# EasyEDA Pro project ProPrj_STM32音响_2025-06-08.epro, schematic Flash&±5V

## Sheets
1 W25Q Flash: Board Name: FLASH@W25Q128; Create Date: 2025-03-12; Page Name: FLASH@W25Q128; Project Name: SCH_FLASH-W25Q128_2025-03-12; Schematic Name: FLASH@W25Q128; Update Date: 2025-03-15; Add into BOM: yes; Convert to PCB: yes; Date: 2017-05-22; Draw By: jixin003; REV: 1.0; Sheet: 1/1
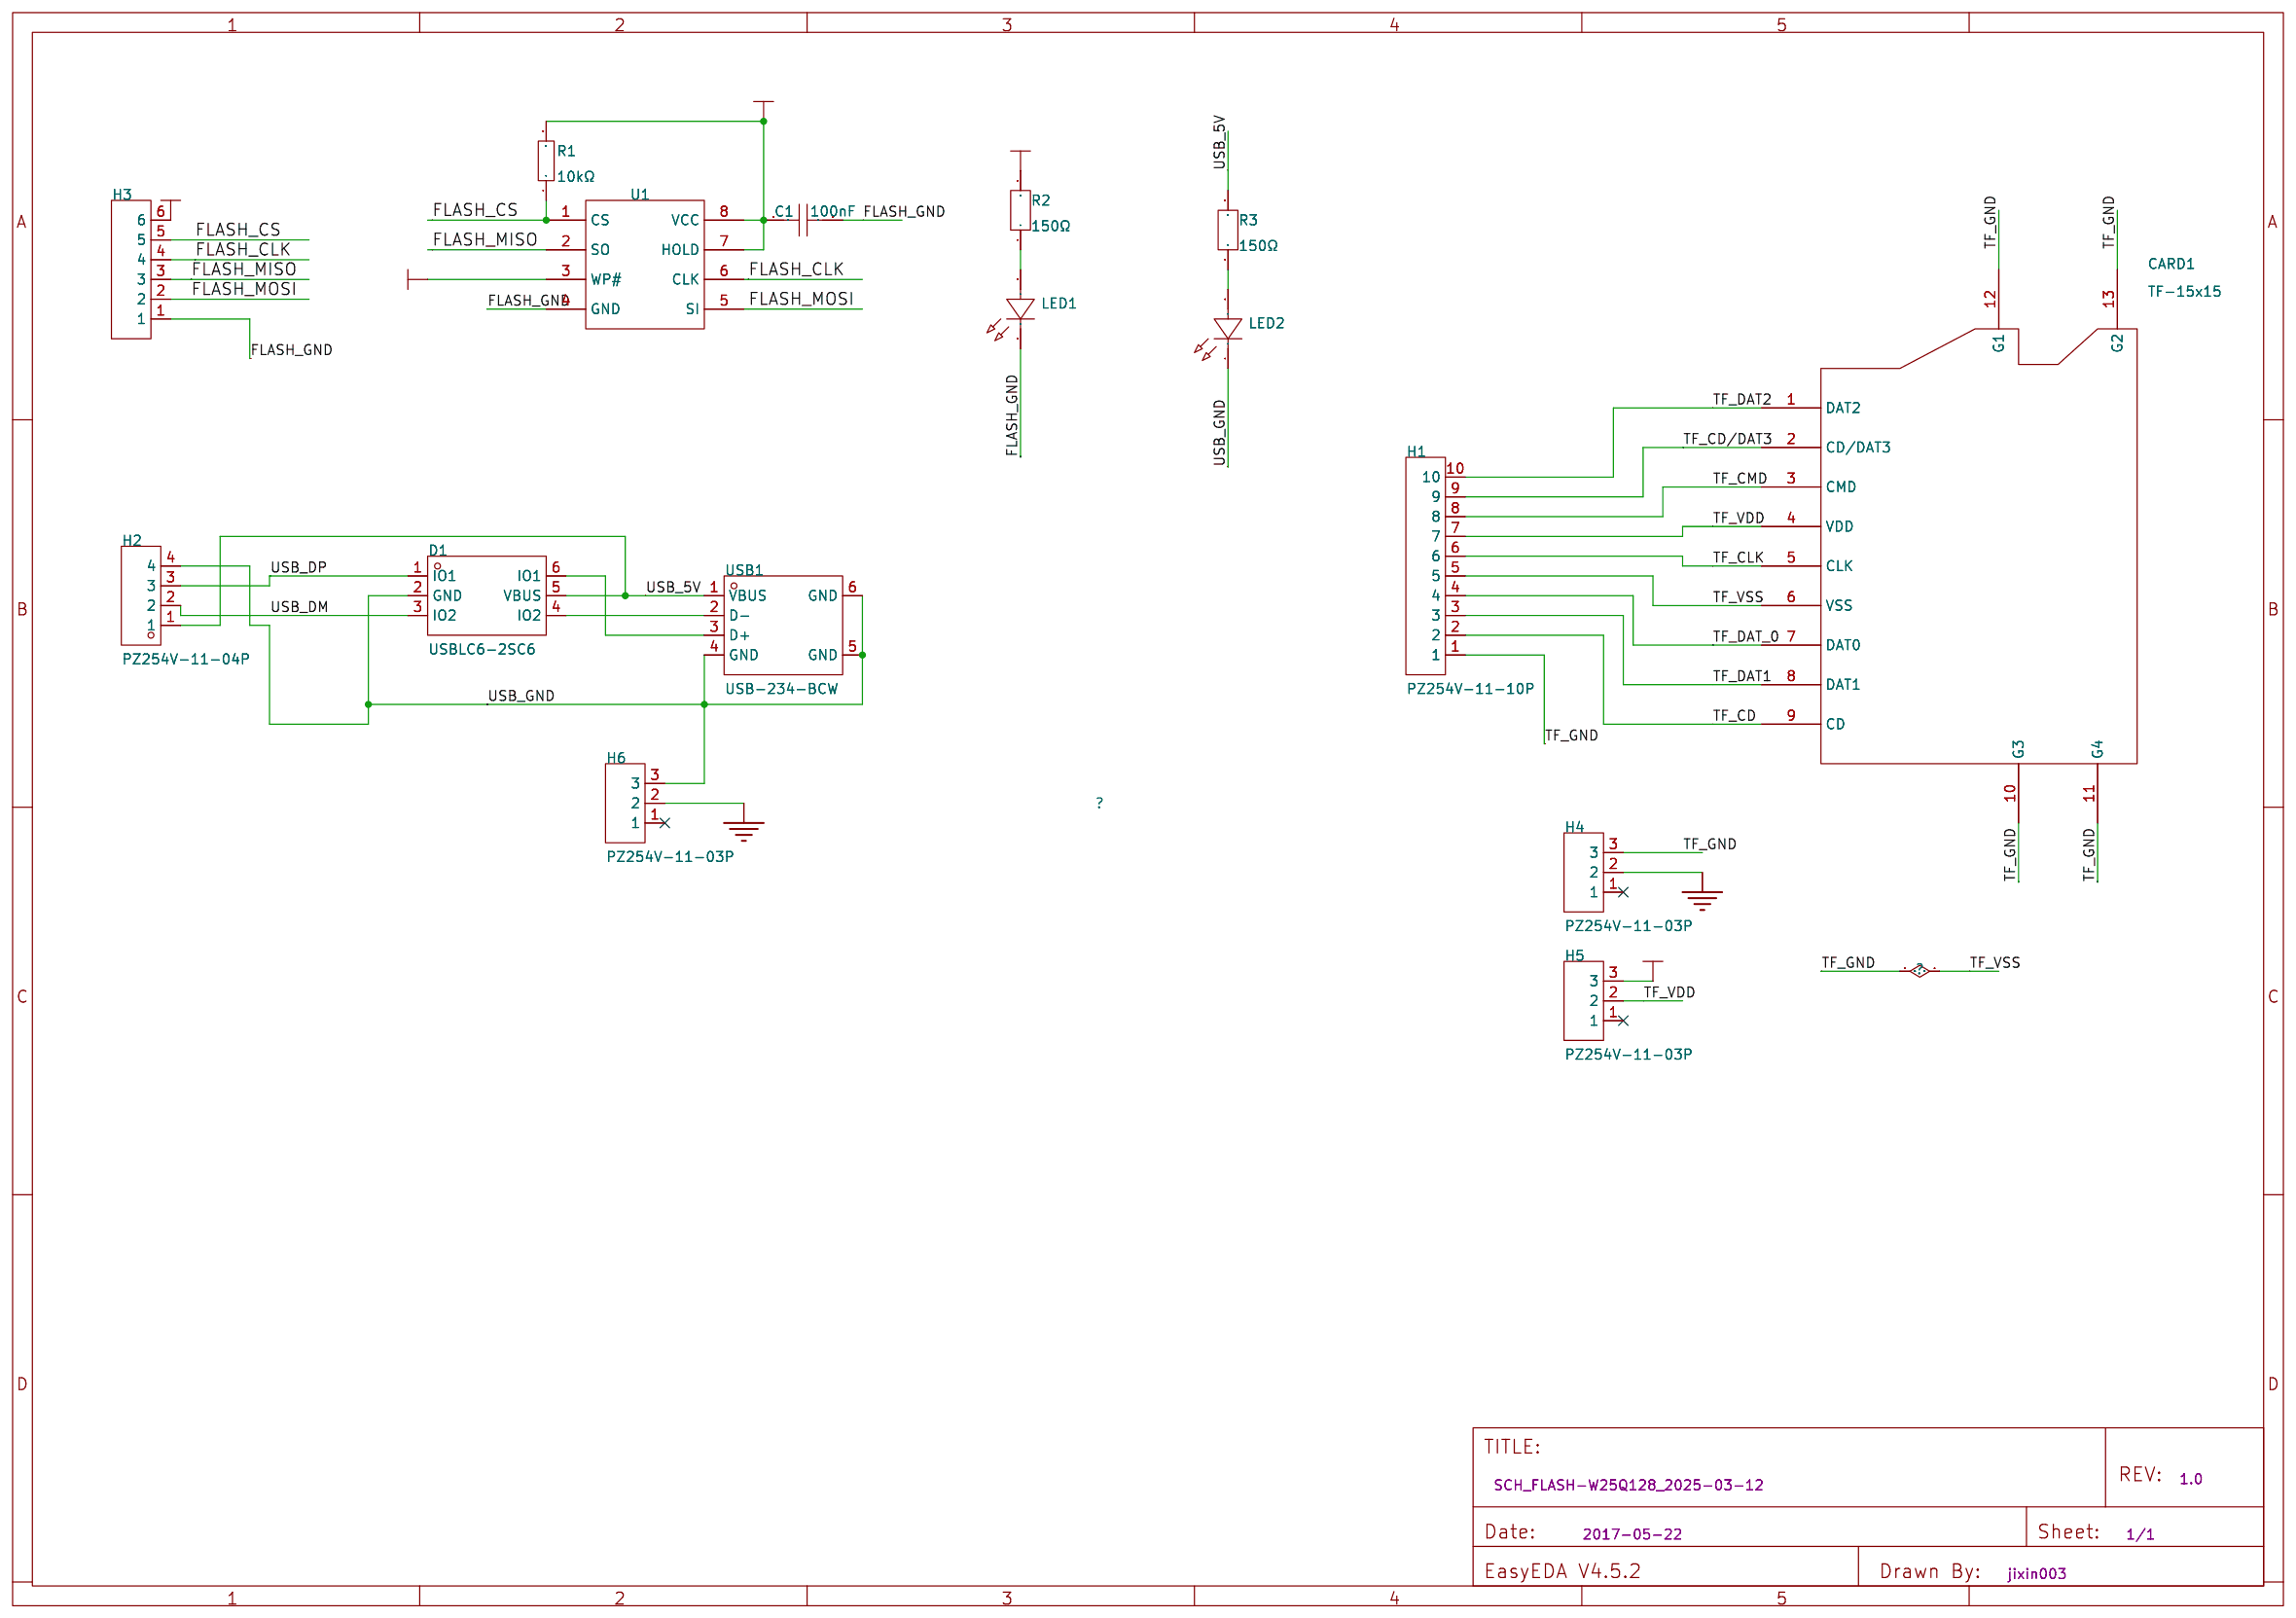
[diagram p2: W25Q Flash]
2 ±5V: Create Date: 2025-03-15; Page Name: P2; Company: 嘉立创EDA; Page Size: A4; Version: V1.0
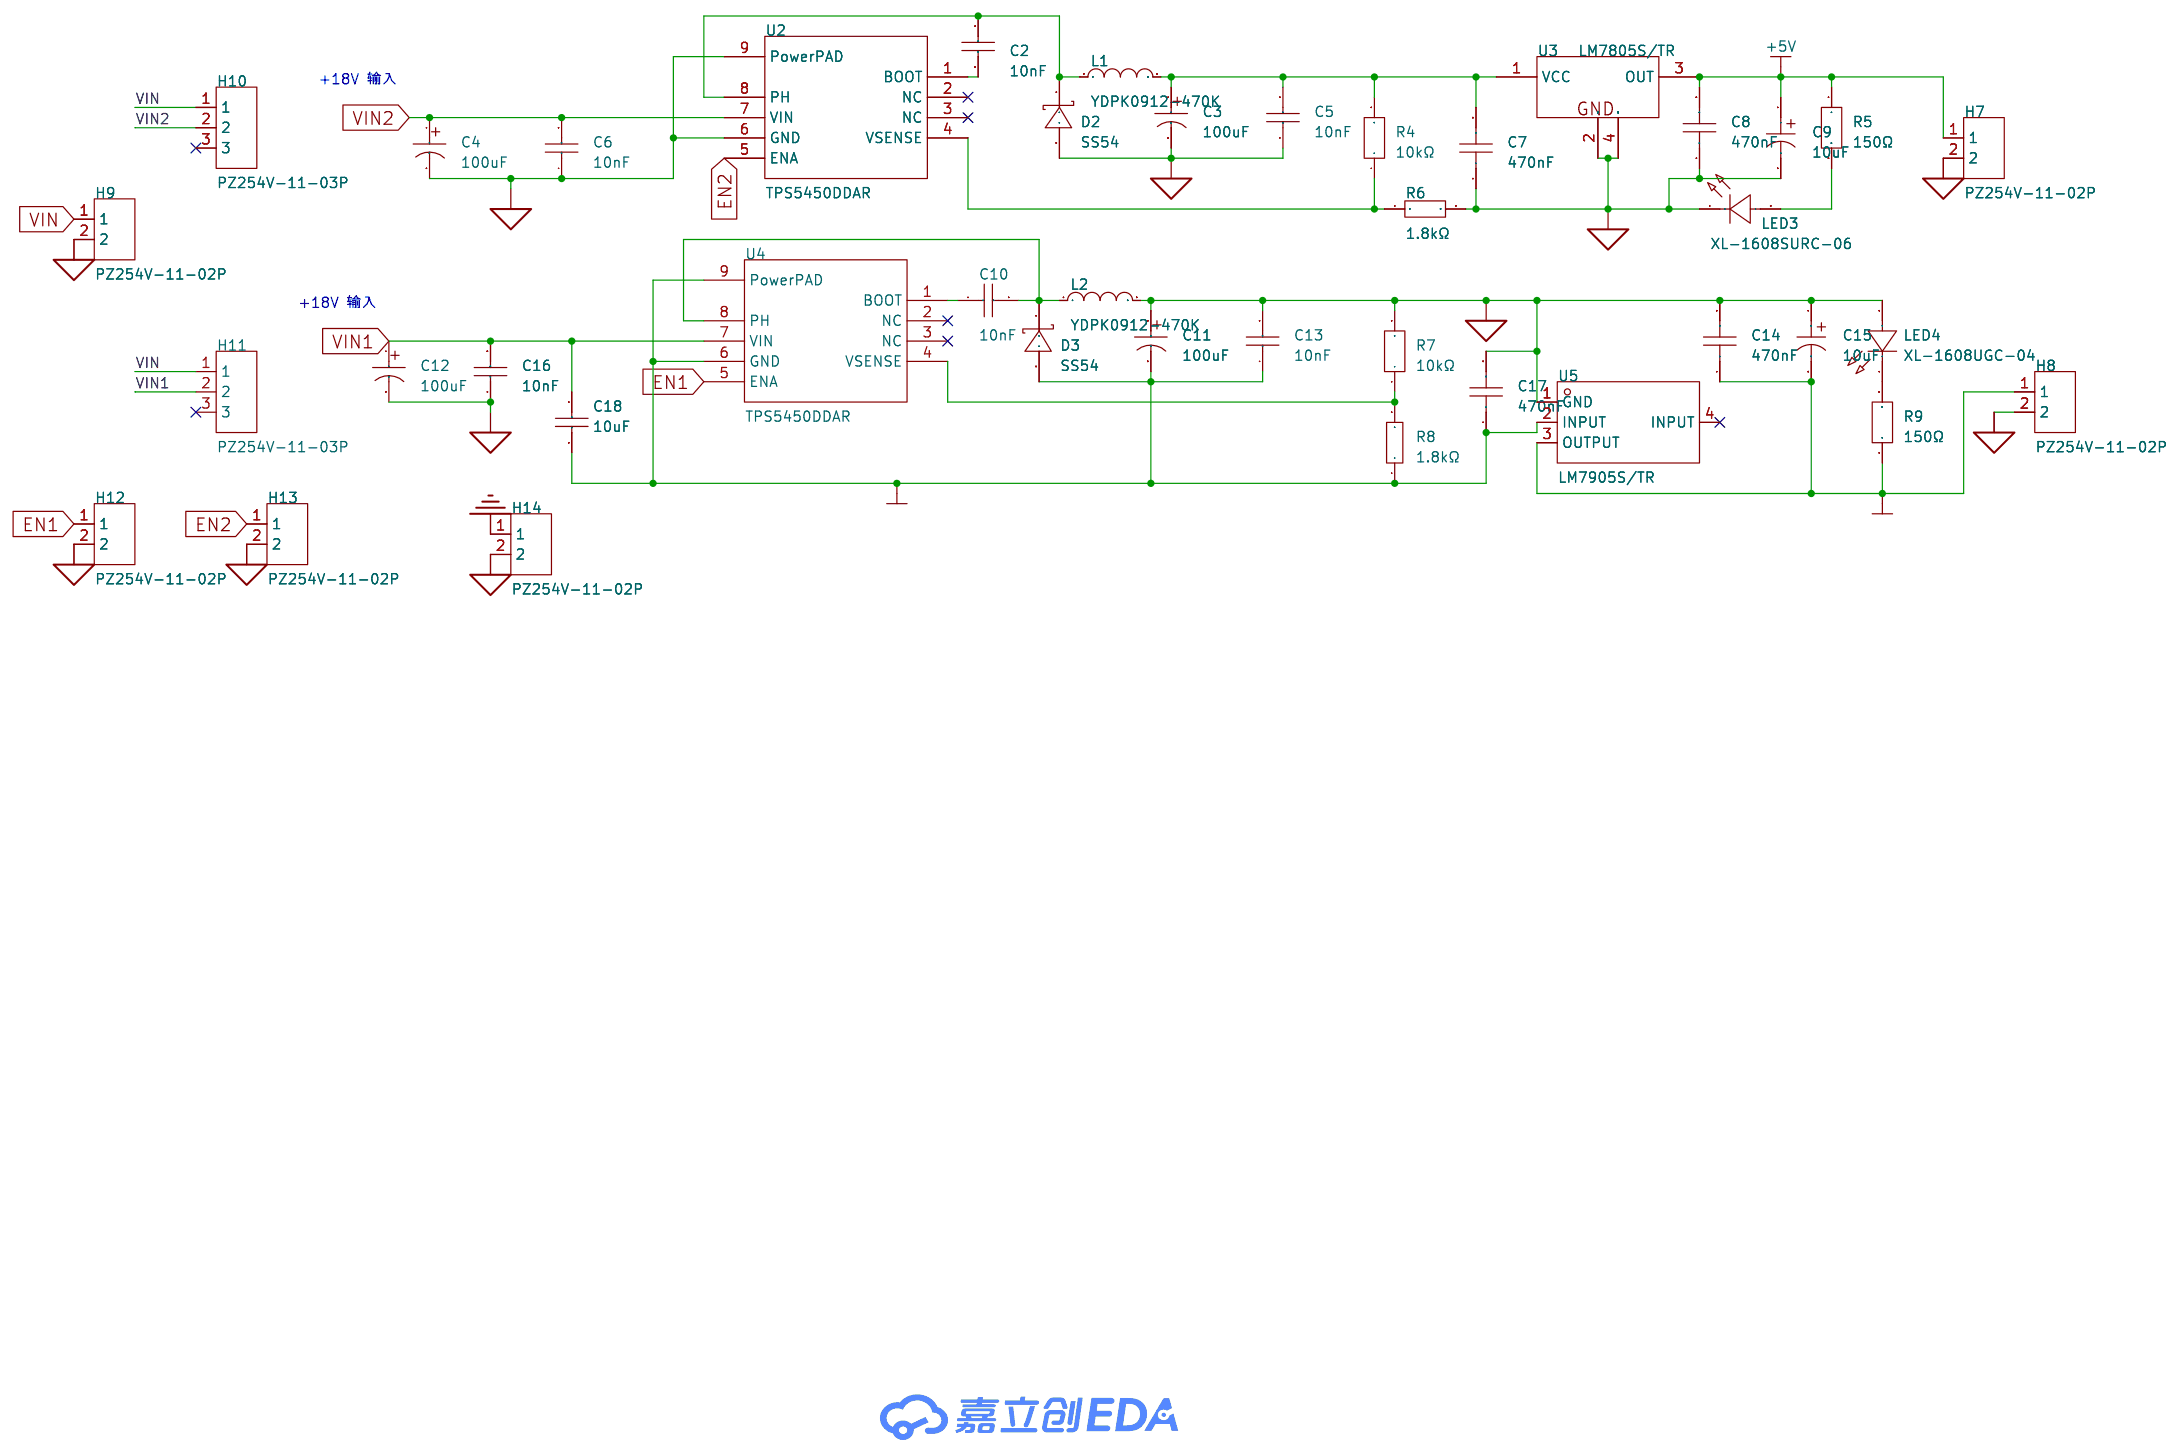
[diagram p3: ±5V]

## Parts
sheet W25Q Flash
C1  100nF  [C0603]
CARD1  TF-15x15  [TF-SMD_TF-15-15]
D1  USBLC6-2SC6  [SOT-23-6_L2.9-W1.6-P0.95-LS2.8-BL]
H1  PZ254V-11-10P  [HDR-TH_10P-P2.54-V-M]
H2  PZ254V-11-04P  [HDR-TH_4P-P2.54-V-M]
H3  PZ254V-11-06P  [HDR-TH_6P-P2.54-V-M]
H4  PZ254V-11-03P  [HDR-TH_3P-P2.54-V-M]
H5  PZ254V-11-03P  [HDR-TH_3P-P2.54-V-M]
H6  PZ254V-11-03P  [HDR-TH_3P-P2.54-V-M]
LED1  XL-1608SURC-06  [LED0603-RD_RED]
LED2  XL-1608SURC-04  [LED0603-RD]
R1  10kΩ  [R0603]
R2  150Ω  [R0603]
R3  150Ω  [R0603]
U1  W25Q128JVSIQ  [SOIC-8_L5.3-W5.3-P1.27-LS8.0-BL]
USB1  USB-234-BCW  [USB-A-SMD_USB-234-BCW]
sheet ±5V
C2  10nF  [C0603]
C3  100uF  [CAP-TH_BD8.0-P3.50-D0.6-FD]
C4  100uF  [CAP-TH_BD8.0-P3.50-D0.6-FD]
C5  10nF  [C0603]
C6  10nF  [C0603]
C7  470nF  [C0603]
C8  470nF  [C0603]
C9  10uF  [CAP-SMD_BD4.0-L4.3-W4.3-LS5.0-FD]
C10  10nF  [C0603]
C11  100uF  [CAP-TH_BD8.0-P3.50-D0.6-FD]
C12  100uF  [CAP-TH_BD8.0-P3.50-D0.6-FD]
C13  10nF  [C0603]
C14  470nF  [C0603]
C15  10uF  [CAP-SMD_BD4.0-L4.3-W4.3-LS5.0-FD]
C16  10nF  [C0603]
C17  470nF  [C0603]
C18  10uF  [C1206]
D2  SS54  [SMA_L4.3-W2.6-LS5.0-RD]
D3  SS54  [SMA_L4.3-W2.6-LS5.0-RD]
H7  PZ254V-11-02P  [HDR-TH_2P-P2.54-V-M]
H8  PZ254V-11-02P  [HDR-TH_2P-P2.54-V-M]
H9  PZ254V-11-02P  [HDR-TH_2P-P2.54-V-M]
H10  PZ254V-11-03P  [HDR-TH_3P-P2.54-V-M]
H11  PZ254V-11-03P  [HDR-TH_3P-P2.54-V-M]
H12  PZ254V-11-02P  [HDR-TH_2P-P2.54-V-M]
H13  PZ254V-11-02P  [HDR-TH_2P-P2.54-V-M]
H14  PZ254V-11-02P  [HDR-TH_2P-P2.54-V-M]
L1  YDPK0912-470K  [IND-TH_BD11.0-P5.00-D0.6]
L2  YDPK0912-470K  [IND-TH_BD11.0-P5.00-D0.6]
LED3  XL-1608SURC-06  [LED0603-RD_RED]
LED4  XL-1608UGC-04  [LED0603-RD_GREEN]
R4  10kΩ  [R0603]
R5  150Ω  [R0603]
R6  1.8kΩ  [R0603]
R7  10kΩ  [R0603]
R8  1.8kΩ  [R0603]
R9  150Ω  [R0603]
U2  TPS5450DDAR  [ESOP-8_L4.9-W3.9-P1.27-LS6.0-TL-EP]
U3  LM7805S/TR  [TO-263-3_L8.6-W10.2-P2.54-LS14.4-BR]
U4  TPS5450DDAR  [ESOP-8_L4.9-W3.9-P1.27-LS6.0-TL-EP]
U5  LM7905S/TR  [TO-263-3L_L10.2-W8.6-P2.54-LS14.4-TL]

## Library data of the parts
C1 = CGA0603X7R104K500JT: 容值:100nF;精度:±10%;额定电压:50V;材质(温度系数):X7R;; LCSC Part Name: 100nF ±10% 50V; Supplier Part: C6119867; Manufacturer: HRE(芯声); Supplier Footprint: 0603; JLCPCB Part Class: Extended Part; Supplier: LCSC; Tolerance: ±10%; Voltage Rated: 50V; Temperature Coefficient: X7R
CARD1 = TF-15x15: 卡连接方式:自弹式;卡类型:MicroSD卡(TF卡);连接器类型:卡座;本体最大高度:-;工作温度范围:-;; LCSC Part Name: 自弹式 MicroSD卡(TF卡) 卡座; Supplier Part: C111196; Manufacturer: SOFNG(硕方); Supplier Footprint: SMD; JLCPCB Part Class: 扩展库; Datasheet: https://atta.szlcsc.com/upload/public/pdf/source/20200911/C111196_6985EA70490FD8F56A5C3F4D017F3786.pdf; Supplier: LCSC; Card Connection Mode: 自弹式; Card Type: MicroSD卡(TF卡); Connector Type: 卡座
D1 = USBLC6-2SC6_C2827654: 极性:单向;反向截止电压(Vrwm):5V;最大钳位电压:12V;峰值脉冲电流(Ipp):6A;峰值脉冲功率(Ppp):150W;击穿电压:6V;; LCSC Part Name: ESD，可防30kV静电; Supplier Part: C2827654; Manufacturer: TECH PUBLIC(台舟); Supplier Footprint: SOT-23-6; JLCPCB Part Class: 扩展库; Datasheet: https://atta.szlcsc.com/upload/public/pdf/source/20210810/FBD75DE717D6D97BAC6DD7F2B5C09DCD.pdf; Supplier: LCSC; polarity: 单向; Reverse Stand-Off Voltage (Vrwm): 5V; Maximum Clamping Voltage: 12V; Peak Pulse Current (Ipp): 6A; Peak Pulse Power Dissipation (Ppp): 150W; Breakdown Voltage: 6V; Reverse Leakage Current (Ir): 80nA; Number of Lines: 双路; Operating Temperature: -55℃~+125℃; level of protection: IEC 61000-4-2; Type: ESD
H1 = PZ254V-11-10P: 插针结构:1x10P;间距:2.54mm;行距:-;圆针/方针:方针;安装方式:直插;排数:单排;总PIN位数:10P;额定电流:-;额定电压:-;配合针长度:6mm;塑高:2.5mm;端接针长度:3mm;触头材质:黄铜;触头镀层:-;工作温度:-40℃~+105℃;颜色:黑色;; LCSC Part Name: 1x10P 间距:2.54mm 方针 直插; Supplier Part: C492409; Manufacturer: XFCN(兴飞); Supplier Footprint: 插件,P=2.54mm; JLCPCB Part Class: Extended Part; Datasheet: https://atta.szlcsc.com/upload/public/pdf/source/20200309/C492409_129C9431BDD62EBBBD0A643B6AAB9FBD.pdf; Supplier: LCSC; Pin Structure: 1x10P; Pitch: 2.54mm; Circluar Pins/Square Pins: 方针; Mounting Type: 直插; Number of Rows: 单排; Number of Pins: 10P; Length of Mating Pin: 6mm; Insulation Height: 2.5mm; Length of End Connection Pin: 3mm; Contact Material: 黄铜; Operating Temperature: -40℃~+105℃; Color: 黑色
H2 = PZ254V-11-04P: 插针结构:1x4P;间距:2.54mm;行距:-;圆针/方针:方针;安装类型:直插;排数:单排;总PIN位数:4P;额定电流:3A;额定电压:250V;配合针长度:6mm;塑高:2.5mm;端接针长度:3mm;触头材质:-;工作温度范围:-40℃~+105℃;颜色:黑色;; LCSC Part Name: 间距:2.54mm 1x4P 直插 方针; Supplier Part: C2691448; Manufacturer: XFCN(兴飞); Supplier Footprint: 插件,P=2.54mm; JLCPCB Part Class: Extended Part; Datasheet: https://atta.szlcsc.com/upload/public/pdf/source/20200309/C492403_F9F19131791D08044AD4F84F8E751A34.pdf; Supplier: LCSC; Pin Structure: 1x4P; Pitch: 2.54mm; Circluar Pins/Square Pins: 方针; Mounting Type: 直插; Number of Rows: 单排; Number of Pins: 4P; Current Rating (Max): 3A; Voltage Rating (Max): 250V; Length of Mating Pin: 6mm; Insulation Height: 2.5mm; Length of End Connection Pin: 3mm; Operating Temperature Range: -40℃~+105℃; Color: 黑色
H3 = PZ254V-11-06P: 插针结构:1x6P;间距:2.54mm;行距:-;圆针/方针:方针;安装方式:直插;排数:单排;总PIN位数:6P;额定电流:-;额定电压:-;配合针长度:6mm;塑高:2.5mm;端接针长度:3mm;触头材质:黄铜;触头镀层:-;工作温度:-40℃~+105℃;颜色:黑色;; LCSC Part Name: 1x6P 间距:2.54mm 方针 直插; Supplier Part: C492405; Manufacturer: XFCN(兴飞); Supplier Footprint: 插件,P=2.54mm; JLCPCB Part Class: Extended Part; Datasheet: https://atta.szlcsc.com/upload/public/pdf/source/20200309/C492405_597F1930F5B55CC3C7FD95458F1C3977.pdf; Supplier: LCSC; Pin Structure: 1x6P; Pitch: 2.54mm; Circluar Pins/Square Pins: 方针; Mounting Type: 直插; Number of Rows: 单排; Number of Pins: 6P; Length of Mating Pin: 6mm; Insulation Height: 2.5mm; Length of End Connection Pin: 3mm; Contact Material: 黄铜; Operating Temperature: -40℃~+105℃; Color: 黑色
H4-H6 H10 H11 = PZ254V-11-03P: 插针结构:1x3P;间距:2.54mm;行距:-;圆针/方针:方针;安装方式:直插;排数:单排;总PIN位数:3P;额定电流:3A;额定电压:250V;配合针长度:6mm;塑高:2.5mm;端接针长度:3mm;工作温度:-40℃~+105℃;颜色:黑色;; LCSC Part Name: 1x3P 间距:2.54mm 方针 直插; Supplier Part: C2937625; Manufacturer: XFCN(兴飞); Supplier Footprint: 插件,P=2.54mm; JLCPCB Part Class: Extended Part; Datasheet: https://atta.szlcsc.com/upload/public/pdf/source/20200309/C492402_8335C3D49C4E4C618838D59BB1D024C1.pdf; Supplier: LCSC; Pin Structure: 1x3P; Pitch: 2.54mm; Circluar Pins/Square Pins: 方针; Mounting Type: 直插; Number of Rows: 单排; Number of Pins: 3P; Current Rating: 3A; Voltage Rating (Max): 250V; Length of Mating Pin: 6mm; Insulation Height: 2.5mm; Length of End Connection Pin: 3mm; Operating Temperature: -40℃~+105℃; Color: 黑色
LED1 LED3 = XL-1608SURC-06: 发光颜色:红色;功率:55mW;正向电流:25mA;主波长:617nm~621nm;透镜颜色:无色透明透镜;色温:-;发光角度:120°;载带方式:正贴;工作温度:-30℃~+85℃;; Supplier Part: C965799; Manufacturer: XINGLIGHT(成兴光); Supplier Footprint: 0603; JLCPCB Part Class: 扩展库; Datasheet: https://atta.szlcsc.com/upload/public/pdf/source/20221102/D860AFDD1CDB02C5A8064103A32707E2.pdf; Supplier: LCSC; Emitted Color: 红色; Power Dissipation: 55mW; Forward Current: 25mA; Dominant Wavelength: 617nm~621nm; Peak Wavelength: 623nm; Lens Color: 无色透明透镜; Viewing Angle: 120°; Mounting Sytle: 正贴; Operating Temperature: -30℃~+85℃
LED2 = XL-1608SURC-04: 发光颜色:红色;功率:55mW;正向电流:25mA;主波长:620nm~625nm;透镜颜色:无色透明透镜;色温:-;发光角度:120°;载带方式:正贴;工作温度:-30℃~+85℃;; Supplier Part: C965798; Manufacturer: XINGLIGHT(成兴光); Supplier Footprint: 0603; JLCPCB Part Class: Extended Part; Datasheet: https://atta.szlcsc.com/upload/public/pdf/source/20240218/F502183F2898F3095876AA716B3D9AB2.pdf; Supplier: LCSC; Emitted Color: 红色; Power Dissipation: 55mW; Forward Current: 25mA; Dominant Wavelength: 620nm~625nm; Peak Wavelength: 625nm; Lens Color: 无色透明透镜; Viewing Angle: 120°; Mounting Sytle: 正贴; Operating Temperature: -30℃~+85℃
R1 = 0603WAF1002T5E: 电阻类型:厚膜电阻;阻值:10kΩ;精度:±1%;功率:100mW;最大工作电压:75V;温度系数:±100ppm/℃;; LCSC Part Name: 厚膜电阻 10kΩ ±1% 100mW; Supplier Part: C25804; Manufacturer: UNI-ROYAL(厚声); Supplier Footprint: 0603; JLCPCB Part Class: 基础库; Datasheet: https://atta.szlcsc.com/upload/public/pdf/source/20200306/C422600_1E6D84923E4A46A82E41ADD87F860B5C.pdf; Supplier: LCSC; Type: 厚膜电阻; Tolerance: ±1%; Power(Watts): 100mW; Overload Voltage (Max): 75V; Temperature Coefficient: ±100ppm/℃; Operating Temperature Range: -55℃~+155℃
R2 R3 R5 R9 = FRC0603J151 TS: 电阻类型:厚膜电阻;阻值:150Ω;精度:±5%;功率:100mW;工作电压:75V;温度系数:±100ppm/℃;; LCSC Part Name: 150Ω ±5% 100mW 厚膜电阻; Supplier Part: C2907103; Manufacturer: FOJAN(富捷); Supplier Footprint: 0603; JLCPCB Part Class: Extended Part; Datasheet: https://atta.szlcsc.com/upload/public/pdf/source/20211221/925EC7D7225764EE0046F22065062C87.pdf; Supplier: LCSC; Type: 厚膜电阻; Tolerance: ±5%; Power(Watts): 100mW; Voltage-Supply(Max): 75V; Temperature Coefficient: ±100ppm/℃; Operating Temperature: -55℃~+155℃
U1 = W25Q128JVSIQ: 接口类型:SPI;存储容量:128Mbit;时钟频率(fc):133MHz;; LCSC Part Name: W25Q128JVSIQ 编带; Supplier Part: C97521; Manufacturer: WINBOND(华邦); Supplier Footprint: SOIC-8-208mil; JLCPCB Part Class: Basic Part; Datasheet: https://atta.szlcsc.com/upload/public/pdf/source/20170316/1489627409956.pdf; Supplier: LCSC; Interface Type: SPI; Memory Size: 128Mbit; Clock Frequency (fc): 133MHz; Supply Voltage: 2.7V~3.6V; Page Programming Time (Tpp): 700us; Block Erase Time (tBE): 120ms@(32KB); Data Retention - TDR (Year): 20年; Operating Temperature: -40℃~+85℃
USB1 = USB-234-BCW: 连接器类型:Type-A;标准:USB 2.0;公母:母;端口数量:1;触点数量:4P;安装方式:卧贴;额定电流 - 电源:1.5A;工作温度范围:-20℃~+70℃;焊接温度(最大值):260℃;; LCSC Part Name: Type-A 母 卧贴; Supplier Part: C720528; Manufacturer: XUNPU(讯普); Supplier Footprint: SMD; JLCPCB Part Class: 扩展库; Datasheet: https://atta.szlcsc.com/upload/public/pdf/source/20200810/C720528_E4736DAF0BDC0C92527D8BAAAC86B8A5.pdf; Supplier: LCSC; Connector Type: Type-A; Standard: USB 2.0; Gender: 母; Number of Ports: 1; Number of Contacts: 4P; Mounting Style: 卧贴; Current Rating - Power (Max): 1.5A; Operating Temperature Range: -20℃~+70℃; Soldering Temperature(Max): 260℃
C2 C5 C6 C10 C13 C16 = CC0603KRX7R9BB103: 容值:10nF;精度:±10%;额定电压:50V;材质(温度系数):X7R;; LCSC Part Name: 10nF ±10% 50V; Supplier Part: C100042; Manufacturer: YAGEO(国巨); Supplier Footprint: 0603; JLCPCB Part Class: 扩展库; Datasheet: https://atta.szlcsc.com/upload/public/pdf/source/20181008/C309510_22F155564471FAF6A489F7D68F34234E.pdf; Supplier: LCSC; Tolerance: ±10%; Voltage Rated: 50V; Temperature Coefficient: X7R
C3 C4 C11 C12 = ERS1HM101F12OT: 容值:100uF;精度:±20%;额定电压:50V;; LCSC Part Name: 100uF ±20% 50V; Supplier Part: C112510; Manufacturer: AISHI(艾华集团); Supplier Footprint: 插件,D8xL12mm; JLCPCB Part Class: 扩展库; Datasheet: https://atta.szlcsc.com/upload/public/pdf/source/20191015/C438940_4B8E60A742BB0AE40DDEF87A5C89089D.pdf; Supplier: LCSC; Tolerance: ±20%; Rated Voltage: 50V; Lead Spacing: 3.5mm; φD: 8mm; L: 12mm; Lifetime @ Temp: 7000hrs@105℃
C7 C8 C14 C17 = CC0603KRX7R9BB474: 容值:470nF;精度:±10%;额定电压:50V;材质(温度系数):X7R;; LCSC Part Name: 470nF ±10% 50V; Supplier Part: C513577; Manufacturer: YAGEO(国巨); Supplier Footprint: 0603; JLCPCB Part Class: 扩展库; Datasheet: https://atta.szlcsc.com/upload/public/pdf/source/20200423/C519417_FF9998E3F66D767819CD86A66B468321.pdf; Supplier: LCSC; Tolerance: ±10%; Voltage Rated: 50V; Temperature Coefficient: X7R
C9 C15 = RVT10UF16V67RV0012: 容值:10uF;精度:±20%;额定电压:16V;纹波电流:17mA@120Hz;; LCSC Part Name: 10uF ±20% 16V; Supplier Part: C2895275; Manufacturer: KNSCHA(科尼盛); Supplier Footprint: SMD,D4xL5.4mm; JLCPCB Part Class: 扩展库; Datasheet: https://atta.szlcsc.com/upload/public/pdf/source/20210913/7C7FF837D47D33EAC77F0CE6D659CCC4.pdf; Supplier: LCSC; Tolerance: ±20%; Rated Voltage: 16V; Ripple Current: 17mA@120Hz; φD: 4mm; L: 5.4mm; Lifetime @ Temp: 2000hrs@105℃; Operating Temperature: -55℃~+105℃
C18 = HGC1206R5106K500NSPJ: 容值:10uF;精度:±10%;额定电压:50V;材质(温度系数):X5R;; LCSC Part Name: 10uF ±10% 50V; Supplier Part: C7432781; Manufacturer: Chinocera(华瓷); Supplier Footprint: 1206; JLCPCB Part Class: Extended Part; Datasheet: https://atta.szlcsc.com/upload/public/pdf/source/20240320/FAC3FEC40A78BC5CCCE96C232A94D860.pdf; Supplier: LCSC; Tolerance: ±10%; Voltage Rated: 50V; Temperature Coefficient: X5R
D2 D3 = SS54_C727065: 二极管配置:独立式;正向压降(Vf):550mV@5A;直流反向耐压(Vr):40V;整流电流:5A;; LCSC Part Name: 电压:40V 电流:5A; Supplier Part: C727065; Manufacturer: TWGMC(台湾迪嘉); Supplier Footprint: SMA(DO-214AC); JLCPCB Part Class: Extended Part; Datasheet: https://atta.szlcsc.com/upload/public/pdf/source/20200828/C727064_BD0A2B36CBC76CEA4B6710C57718D41F.pdf; Supplier: LCSC; Diode Configuration: 独立式; Forward Voltage (Vf@If): 550mV@5A; Reverse Voltage (Vr): 40V; Rectified Current: 5A; Reverse Leakage Current (Ir): 500uA
H7-H9 H12-H14 = PZ254V-11-02P: 插针结构:1x2P;间距:2.54mm;行距:-;圆针/方针:方针;安装方式:直插;排数:单排;总PIN位数:2P;额定电流:-;额定电压:-;配合针长度:6mm;塑高:2.5mm;端接针长度:3mm;触头材质:黄铜;触头镀层:-;工作温度:-40℃~+105℃;颜色:黑色;; LCSC Part Name: 1x2P 间距:2.54mm 方针 直插; Supplier Part: C492401; Manufacturer: XFCN(兴飞); Supplier Footprint: 插件,P=2.54mm; JLCPCB Part Class: 扩展库; Datasheet: https://atta.szlcsc.com/upload/public/pdf/source/20200309/C492401_A812433581A9B211A7FFA413ADDFF0E5.pdf; Supplier: LCSC; Pin Structure: 1x2P; Pitch: 2.54mm; Circluar Pins/Square Pins: 方针; Mounting Type: 直插; Number of Rows: 单排; Number of Pins: 2P; Length of Mating Pin: 6mm; Insulation Height: 2.5mm; Length of End Connection Pin: 3mm; Contact Material: 黄铜; Operating Temperature: -40℃~+105℃; Color: 黑色
L1 L2 = YDPK0912-470K: 电感值：47uH 精度：±10% 饱和电流：3.0A 直流电阻(DCR)：115mΩ Max. 工字电感 DR2W9*12 长脚; LCSC Part Name: 9*12 47uH ±10% 3A 115mΩ; Supplier Part: C22395842; Manufacturer: YJYCOIN(益嘉源); Supplier Footprint: 插件,D11xL15mm; JLCPCB Part Class: Extended Part; Datasheet: https://atta.szlcsc.com/upload/public/pdf/source/20240511/E38727AF61E03A2C575868D4A17557A5.pdf; Supplier: LCSC
LED4 = XL-1608UGC-04: 灯头类型:-;发光颜色:翠绿色;正向电压(VF):-;功率:80mW;正向电流:25mA;主波长:516nm~525nm;二极管配置:独立二极管;透镜颜色:无色透明透镜;色温:-;发光强度:-;发光角度:120°;载带方式:正贴;工作温度:-30℃~+85℃;; Supplier Part: C965804; Manufacturer: XINGLIGHT(成兴光); Supplier Footprint: 0603; JLCPCB Part Class: 扩展库; Datasheet: https://atta.szlcsc.com/upload/public/pdf/source/20221102/520D6E465E5CFD1609C8A4DBC80D4018.pdf; Supplier: LCSC; Emitted Color: 翠绿色; Power Dissipation: 80mW; Forward Current: 25mA; Dominant Wavelength: 516nm~525nm; Peak Wavelength: 534nm; Diode Configuration: 独立二极管; Lens Color: 无色透明透镜; Viewing Angle: 120°; Mounting Sytle: 正贴; Operating Temperature: -30℃~+85℃
R4 R7 = FRC0603J103TS: 电阻类型:厚膜电阻;阻值:10kΩ;精度:±5%;功率:100mW;最大工作电压:75V;温度系数:±100ppm/℃;; LCSC Part Name: 10kΩ ±5% 100mW 厚膜电阻; Supplier Part: C2930027; Manufacturer: FOJAN(富捷); Supplier Footprint: 0603; JLCPCB Part Class: Extended Part; Datasheet: https://atta.szlcsc.com/upload/public/pdf/source/20211221/925EC7D7225764EE0046F22065062C87.pdf; Supplier: LCSC; Type: 厚膜电阻; Tolerance: ±5%; Power(Watts): 100mW; Overload Voltage (Max): 75V; Temperature Coefficient: ±100ppm/℃; Operating Temperature Range: -55℃~+155℃
R6 R8 = 0603WAF1801T5E: 电阻类型:厚膜电阻;阻值:1.8kΩ;精度:±1%;功率:100mW;最大工作电压:75V;温度系数:±100ppm/℃;; LCSC Part Name: 1.8kΩ ±1% 100mW 厚膜电阻; Supplier Part: C4177; Manufacturer: UNI-ROYAL(厚声); Supplier Footprint: 0603; JLCPCB Part Class: 基础库; Datasheet: https://atta.szlcsc.com/upload/public/pdf/source/20200306/C422600_1E6D84923E4A46A82E41ADD87F860B5C.pdf; Supplier: LCSC; Type: 厚膜电阻; Tolerance: ±1%; Power(Watts): 100mW; Overload Voltage (Max): 75V; Temperature Coefficient: ±100ppm/℃; Operating Temperature Range: -55℃~+155℃
U2 U4 = TPS5450DDAR: 功能类型:降压型;输出类型:可调;工作电压:5.5V~36V;输出电压:1.221V~31.32V;输出电流:5A;; LCSC Part Name: 5A宽输入范围降压转换器; Supplier Part: C114425; Manufacturer: TI(德州仪器); Supplier Footprint: SOP-8-EP-150mil; JLCPCB Part Class: Extended Part; Datasheet: https://www.ti.com/cn/lit/gpn/tps5450; Supplier: LCSC; Function: 降压型; Output Type: 可调; Input Voltage: 5.5V~36V; Output Voltage: 1.221V~31.32V; Output Current (Max): 5A; Switching Frequency: 500kHz; Operating Temperature: -40℃~+125℃@(TJ); Synchronous Rectification: 否; Number of Outputs: 1; Topology: 降压式; Switch tube (built-in/external): 内置; Output Current: 5A
U3 = LM7805S/TR: 输出类型:-;; LCSC Part Name: 固定电压稳压器; Supplier Part: C507146; Manufacturer: HGSEMI(华冠); Supplier Footprint: TO-263-3; JLCPCB Part Class: 扩展库; Datasheet: https://atta.szlcsc.com/upload/public/pdf/source/20211101/54C90BF39C07253AC431AF453924CB99.pdf; Supplier: LCSC
U5 = LM7905S/TR: 输出电压:5V;; Supplier Part: C2926297; Manufacturer: HGSEMI(华冠); Supplier Footprint: TO-263-3; JLCPCB Part Class: 扩展库; Datasheet: https://atta.szlcsc.com/upload/public/pdf/source/20220921/D54579C407B8098A57F5285C42DC4416.pdf; Supplier: LCSC; Output Voltage: 5V; Feature: 热保护(TSD)

## Nets
+5V: C8.2 C9.1 H7.1 R5.1 U3.3(OUT)
-5V: C14.1 C15.2 H8.1 R9.1 U5.3(OUTPUT)
-8V: C11.2 C13.1 C17.1 C18.2 D3.2(A) R8.1 U4.6(GND) U4.9(PowerPAD) U5.2(INPUT)
AGND: C3.2 C4.2 C5.1 C6.1 C7.1 C8.1 C9.2 C11.1 C12.2 C13.2 C14.2 C15.1 C16.1 C17.2 D2.2(A) H7.2 H8.2 H9.2 H12.2 H13.2 H14.2 L2.2 LED3.1(K) LED4.2(A) R6.2 R7.2 U2.6(GND) U2.9(PowerPAD) U3.2(GND) U3.4(GND) U5.1(GND)
GND: H4.2 H6.2 H14.1
VCC_3V3: U1.3(WP#)
VIN: H9.1 H10.1 H11.1
VIN1: C12.1 C16.2 C18.1 H11.2 U4.7(VIN)
VIN2: C4.1 C6.2 H10.2 U2.7(VIN)
EN1: H12.1 U4.5(ENA)
EN2: H13.1 U2.5(ENA)
FLASH_3V3: C1.2 H3.6 H5.3 R1.2 R2.2 U1.7(HOLD) U1.8(VCC)
FLASH_CLK: H3.4 U1.6(CLK)
FLASH_CS: H3.5 R1.1 U1.1(CS)
FLASH_GND: C1.1 H3.1 LED1.1(K) U1.4(GND)
FLASH_MISO: H3.3 U1.2(SO)
FLASH_MOSI: H3.2 U1.5(SI)
TF_CD: CARD1.9(CD) H1.2
TF_CD/DAT3: CARD1.2(CD/DAT3) H1.9
TF_CLK: CARD1.5(CLK) H1.6
TF_CMD: CARD1.3(CMD) H1.8
TF_DAT1: CARD1.8(DAT1) H1.3
TF_DAT2: CARD1.1(DAT2) H1.10
TF_DAT_0: CARD1.7(DAT0) H1.4
TF_GND: CARD1.6(VSS) CARD1.10(G3) CARD1.11(G4) CARD1.12(G1) CARD1.13(G2) H1.1 H1.5 H4.3
TF_VDD: CARD1.4(VDD) H1.7 H5.2
USB_5V: D1.5(VBUS) H2.1 R3.2 USB1.1(VBUS)
USB_DM: D1.3(IO2) H2.2
USB_DP: D1.1(IO1) H2.3
USB_GND: D1.2(GND) H2.4 H6.3 LED2.1(K) USB1.4(GND) USB1.5(GND) USB1.6(GND)
$1N555: LED1.2(A) R2.1
$1N1301: D1.6(IO1) USB1.3(D+)
$1N1307: D1.4(IO2) USB1.2(D-)
$1N2522: LED2.2(A) R3.1
$2N657: R4.1 R6.1 U2.4(VSENSE)
$2N659: C2.1 D2.1(K) L1.1 U2.8(PH)
$2N661: C3.1 C5.2 C7.2 L1.2 R4.2 U3.1(VCC)
$2N662: C2.2 U2.1(BOOT)
$2N1821: R7.1 R8.2 U4.4(VSENSE)
$2N1824: C10.1 U4.1(BOOT)
$2N1940: C10.2 D3.1(K) L2.1 U4.8(PH)
$2N2409: LED4.1(K) R9.2
$2N2614: LED3.2(A) R5.2

Not connected (* = marked no-connect by the designer): H4 1*; H5 1*; H6 1*; H10 3*; H11 3*; U2 2(NC)* 3(NC)*; U4 2(NC)* 3(NC)*; U5 4(INPUT)*

## Notes on the sheets
sheet 2
- +18V 输入
- +18V 输入
